# Altium schematic sheet ST-LinkV2.SchDoc
size B; SheetNumber: 5; SheetTotal: 6
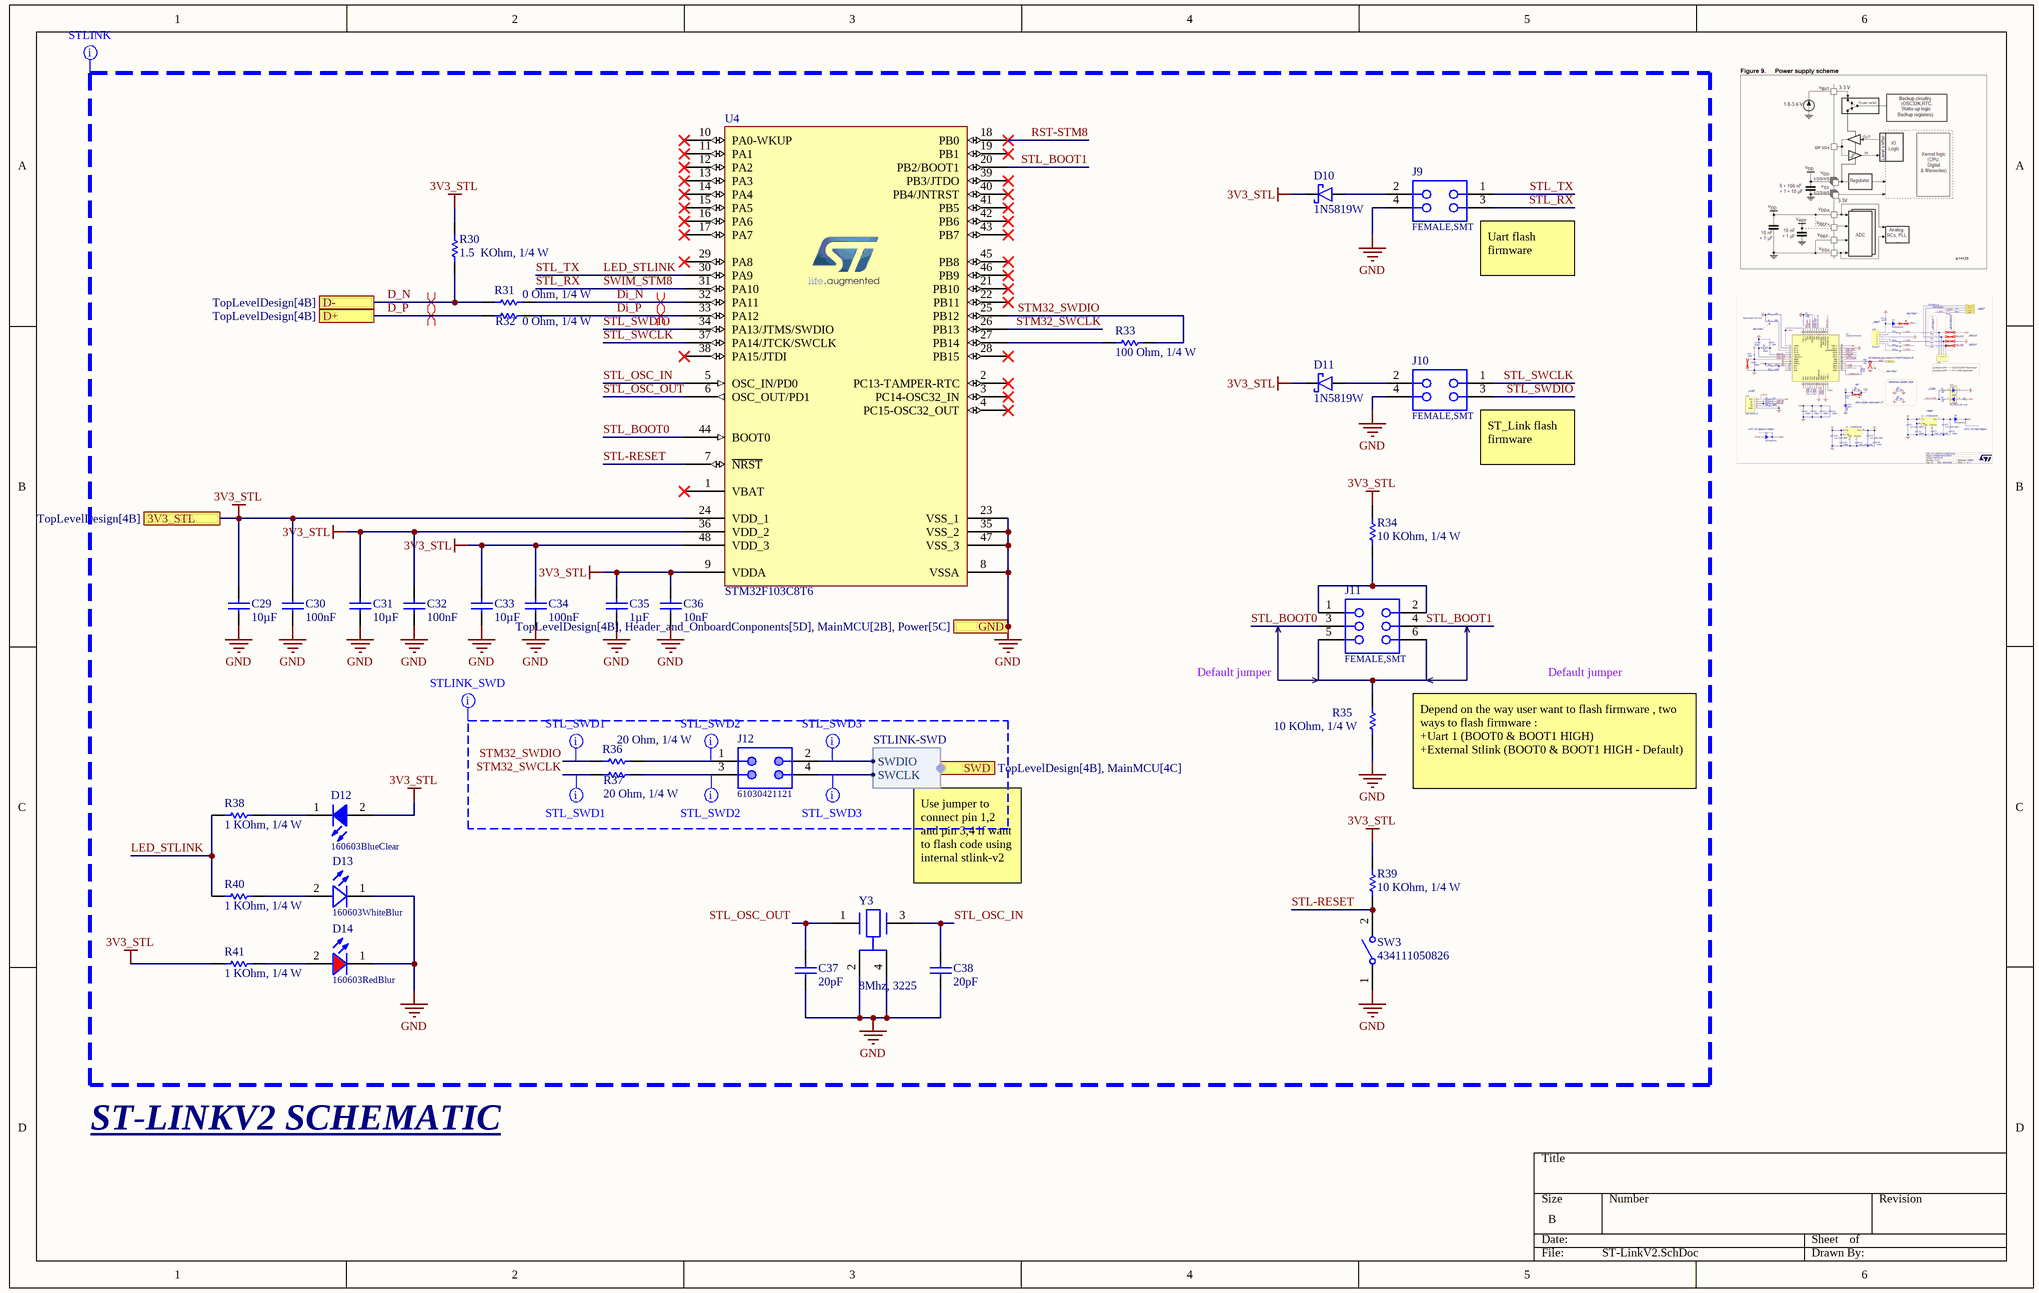
[diagram p0: ST-LinkV2.SchDoc]

## Parts
C29  value 10µF  [CAP_0603]  (hidden comment: 0106031061010)
C30  value 100nF  [CAP_0603]  (hidden comment: 0106031041050)
C31  value 10µF  [CAP_0603]  (hidden comment: 0106031061010)
C32  value 100nF  [CAP_0603]  (hidden comment: 0106031041050)
C33  value 10µF  [CAP_0603]  (hidden comment: 0106031061010)
C34  value 100nF  [CAP_0603]  (hidden comment: 0106031041050)
C35  value 1µF  [CAP_0603]  (hidden comment: 0106031051016)
C36  value 10nF  [CAP_0603]  (hidden comment: 0106031030550)
C37  value 20pF  [CAP_0603]  (hidden comment: 0106031000550)
C38  value 20pF  [CAP_0603]  (hidden comment: 0106031000550)
D10  1N5819W  [1N5819W]
D11  1N5819W  [1N5819W]
D12  160603BlueClear  [WL-SMCW_0603_H=0.7mm]
D13  160603WhiteBlur  [WL-SMCW_0603_H=0.7mm]
D14  160603RedBlur  [WL-SMCW_0603_H=0.7mm]
J9  FEMALE,SMT  [61000421821]
J10  FEMALE,SMT  [61000421821]
J11  FEMALE,SMT  [61030621821]
J12  61030421121  [61030421121]
R30  value 1.5  KOhm, 1/4 W  [resistor_0603]  (hidden comment: 0006031521)
R31  value 0 Ohm, 1/4 W  [resistor_0603]  (hidden comment: 0006030001)
R32  value 0 Ohm, 1/4 W  [resistor_0603]  (hidden comment: 0006030001)
R33  value 100 Ohm, 1/4 W  [resistor_0603]  (hidden comment: 0006031011)
R34  value 10 KOhm, 1/4 W  [resistor_0603]  (hidden comment: 0006031031)
R35  value 10 KOhm, 1/4 W  [resistor_0603]  (hidden comment: 0006031031)
R36  value 20 Ohm, 1/4 W  [resistor_0603]  (hidden comment: 0006032001)
R37  value 20 Ohm, 1/4 W  [resistor_0603]  (hidden comment: 0006032001)
R38  value 1 KOhm, 1/4 W  [resistor_0603]  (hidden comment: 0006031021)
R39  value 10 KOhm, 1/4 W  [resistor_0603]  (hidden comment: 0006031031)
R40  value 1 KOhm, 1/4 W  [resistor_0603]  (hidden comment: 0006031021)
R41  value 1 KOhm, 1/4 W  [resistor_0603]  (hidden comment: 0006031021)
SW3  434111050826  [WS-TASV_L6W3.5H5_4341x10508x6]
U4  STM32F103C8T6  [STM32F103C8T6]
Y3  8Mhz, 3225  [FP-NX3225SA-MFG]

## Ports
3V3_STL (see TopLevelDesign[4B]), D+ (see TopLevelDesign[4B]), D- (see TopLevelDesign[4B]), GND (see TopLevelDesign[4B], Header_and_OnboardConponents[5D], MainMCU[2B], Power[5C]), SWD (harness STLINK-SWD, see TopLevelDesign[4B], MainMCU[4C])

## Harnesses
STLINK-SWD: SWDIO, SWCLK

## Nets
3V3_STL: C29.2 C30.2 C31.2 C32.2 C33.2 C34.2 C35.2 C36.2 D10.K D11.K D12.2(A) R30.2 R34.2 R39.2 R41.1 U4.9(VDDA) U4.24(VDD_1) U4.36(VDD_2) U4.48(VDD_3) ; port 3V3_STL
GND: C29.1 C30.1 C31.1 C32.1 C33.1 C34.1 C35.1 C36.1 C37.1 C38.1 D13.1(K) D14.1(K) J9.4 J10.4 R35.1 SW3.1 U4.8(VSSA) U4.23(VSS_1) U4.35(VSS_2) U4.47(VSS_3) Y3.2(GND) Y3.4(GND) ; port GND
D_N: R30.1 R31.1 ; port D-
D_P: R32.1 ; port D+
Di_N: R31.2 U4.32(PA11)
Di_P: R32.2 U4.33(PA12)
LED_STLINK: J9.1 R38.1 R40.1 U4.30(PA9)  [also labelled STL_TX]
RST-STM8: U4.18(PB0)
STL-RESET: R39.1 SW3.2 U4.7(~{NRST})
STL_BOOT0: J11.3 U4.44(BOOT0)
STL_BOOT1: J11.4 U4.20(PB2/BOOT1)
STL_OSC_IN: C38.2 U4.5(OSC_IN/PD0) Y3.3
STL_OSC_OUT: C37.2 U4.6(OSC_OUT/PD1) Y3.1
STL_RX: J9.3 U4.31(PA10)  [also labelled SWIM_STM8]
STL_SWCLK: J10.1 U4.37(PA14/JTCK/SWCLK)
STL_SWDIO: J10.3 U4.34(PA13/JTMS/SWDIO)
STM32_SWCLK: R37.1 U4.26(PB13)
STM32_SWDIO: R33.1 R36.1 U4.25(PB12)
NetD10_A: D10.A J9.2
NetD11_A: D11.A J10.2
NetD12_1: D12.1(K) R38.2
NetD13_2: D13.2(A) R40.2
NetD14_2: D14.2(A) R41.2
NetJ11_1: J11.1 J11.2 R34.1
NetJ11_5: J11.5 J11.6 R35.2
NetJ12_1: J12.1 R36.2
NetJ12_2: J12.2 ; port SWD.SWDIO
NetJ12_3: J12.3 R37.2
NetJ12_4: J12.4 ; port SWD.SWCLK
NetR33_2: R33.2 U4.27(PB14)

Not connected (* = marked no-connect by the designer): U4 1(VBAT)* 2(PC13-TAMPER-RTC)* 3(PC14-OSC32_IN)* 4(PC15-OSC32_OUT)* 10(PA0-WKUP)* 11(PA1)* 12(PA2)* 13(PA3)* 14(PA4)* 15(PA5)* 16(PA6)* 17(PA7)* 19(PB1)* 21(PB10)* 22(PB11)* 28(PB15)* 29(PA8)* 38(PA15/JTDI)* 39(PB3/JTDO)* 40(PB4/JNTRST)* 41(PB5)* 42(PB6)* 43(PB7)* 45(PB8)* 46(PB9)*

## Layout directives
differential pair: D_N, D_P, Di_N, Di_P
net class STLINK_SWD; rule Matched Net Lengths [Delay Tolerance = 70ps]: STM32_SWCLK, STM32_SWDIO
net class STLINK; rule Differential Pairs Routing [Pref Gap = 10mil    Min Gap  = 10mil    Max Gap  = 10milPref Width = 7mil    Min Width  = 7mil    Max Width  = 10mil]: 3V3_STL, D_N, D_P, Di_N, Di_P, GND, LED_STLINK, RST-STM8, STL-RESET, STL_BOOT0, STL_BOOT1, STL_OSC_IN, STL_OSC_OUT, STL_RX, STL_SWCLK, STL_SWDIO, STL_TX, STM32_SWCLK, STM32_SWDIO, SWIM_STM8
rule Matched Net Lengths [Delay Tolerance = 50ps]; net class STL_SWD1: STM32_SWCLK, STM32_SWDIO
rule Matched Net Lengths [Delay Tolerance = 50ps]; net class STL_SWD2: NetJ12_1, NetJ12_3
rule Matched Net Lengths [Delay Tolerance = 50ps]; net class STL_SWD3: NetJ12_2, NetJ12_4

## Notes on the sheet
- (near J9) Uart flash firmware
- (near J10) ST_Link flash firmware
- Default jumper
- Depend on the way user want to flash firmware , two ways to flash firmware :
  +Uart 1 (BOOT0 & BOOT1 HIGH)
  +External Stlink (BOOT0 & BOOT1 HIGH - Default)
- (near Y3) Use jumper to connect pin 1,2 and pin 3,4 if want to flash code using internal stlink-v2
- ST-LINKV2 SCHEMATIC

## Library data of the parts
C29 C31 C33 = CMP-001-00219-1: CAP, size 0603, 10 uF, 10 VDC; Manufacture Name: Samsung Electro-Mechanics; Manufacture SN: CL10A106KP8NNWC; Voltage Rating DC: 10 VDC; Tolerance: 10%; Supplier 3 Name: thegioiic; Supplier 2 Name: Digi-Key; Design Item ID: 0106031061010; Size: 0603; Packaging: Tape and Reel; Supplier 1 URL: https://www.mouser.vn/ProductDetail/Samsung-Electro-Mechanics/CL10A106KP8NNWC?qs=xZ%2FP%252Ba9zWqZx8LSX23YqWA%3D%3D&utm_source=mouser-refine-download&utm_medium=file&utm_campaign=CL10A106KP8NNWC&utm_content=Samsung-Electro-Mechanics; Supplier 3 SN: N/A; Component Type: Standard; Supplier 2 SN: 1276-CL10A106KP8NNWCTR-ND; Supplier 1 Name: Mouser; Supplier 2 URL: https://www.digikey.com/en/products/detail/samsung-electro-mechanics/cl10a106kp8nnwc/16572907; Source: Capacitor_0603_10_percent.SchLib; Supplier 3 URL: https://www.thegioiic.com/tu-gom-0603-10uf-25v; Pins: 2; Supplier 1 SN: 187-CL10A106KP8NNWC; Operating Temperature: -55 to +125degC; Mounting Technology: SMT
C30 C32 C34 = CMP-001-00214-1: CAP, size 0603, 100 nF, 50 VDC; Manufacture SN: CGA3E3X8R1H104K080AE; Manufacture Name: TDK; Tolerance: 10%; Voltage Rating DC: 50 VDC; Supplier 2 Name: Digi-Key; Pins: 2; Supplier 3 Name: thegioiic; Design Item ID: 0106031041050; Supplier 1 Name: Mouser; Supplier 1 URL: https://www.mouser.com/ProductDetail/TDK/CGA3E3X8R1H104K080AE?qs=nQSIdc08i%252Bd8g3IRRgU2bw%3D%3D&utm_source=mouser-refine-download&utm_medium=file&utm_campaign=CGA3E3X8R1H104K080AE&utm_content=TDK; Size: 0603; Supplier 2 URL: https://www.digikey.com/en/products/detail/tdk-corporation/cga3e3x8r1h104k080ae/5809262; Operating Temperature: -55 to +125degC; Packaging: Tape and Reel; Source: Capacitor_0603_10_percent.SchLib; Supplier 1 SN: 810-CGA3E3X8R1H104KA; Supplier 3 SN: N/A; Supplier 2 SN: 445-173697-2-ND; Mounting Technology: SMT; Supplier 3 URL: N/A; Component Type: Standard
C35 = CMP-001-00215-1: CAP, size 0603, 1 uF, 16 VDC; Manufacture Name: Samsung Electro-Mechanics; Manufacture SN: CL10B105KO8NNWC; Voltage Rating DC: 16 VDC; Tolerance: 10%; Supplier 3 Name: thegioiic; Operating Temperature: -55 to +125degC; Supplier 2 URL: https://www.digikey.com/en/products/detail/samsung-electro-mechanics/cl10b105ko8nnwc/16572783; Supplier 1 Name: Mouser; Supplier 2 Name: Digi-Key; Component Type: Standard; Source: Capacitor_0603_10_percent.SchLib; Packaging: Tape and Reel; Mounting Technology: SMT; Supplier 2 SN: 1276-CL10B105KO8NNWCTR-ND; Size: 0603; Pins: 2; Supplier 1 URL: https://www.mouser.vn/ProductDetail/Samsung-Electro-Mechanics/CL10B105KO8NNWC?qs=81r%252BiQLm7BT%252BXtc72qn1ug%3D%3D&utm_source=mouser-refine-download&utm_medium=file&utm_campaign=CL10B105KO8NNWC&utm_content=Samsung-Electro-Mechanics; Supplier 3 SN: N/A; Supplier 1 SN: 187-CL10B105KO8NNWC; Design Item ID: 0106031051016; Supplier 3 URL: https://www.thegioiic.com/tu-gom-0603-1uf-16v
C36 = CMP-001-00212-1: CAP, size 0603, 10 nF, 50 VDC; Manufacture SN: CGA3E2C0G1H103J080AE; Manufacture Name: TDK; Tolerance: 5%; Voltage Rating DC: 50 VDC; Design Item ID: 0106031030550; Pins: 2; Operating Temperature: -55 to +125degC; Packaging: Tape and Reel; Supplier 1 SN: 810-CGA3E2C0G1H103J8; Source: Capacitor_0603_5_percent.SchLib; Supplier 3 URL: N/A; Component Type: Standard; Supplier 3 SN: N/A; Supplier 2 Name: Digi-Key; Mounting Technology: SMT; Supplier 3 Name: thegioiic; Supplier 1 URL: https://www.mouser.com/ProductDetail/TDK/CGA3E2C0G1H103J080AE?qs=P1JMDcb91o6ZkMITrWTUZQ%3D%3D&utm_source=mouser-refine-download&utm_medium=file&utm_campaign=CGA3E2C0G1H103J080AE&utm_content=TDK; Supplier 2 URL: https://www.digikey.com/en/products/detail/tdk-corporation/cga3e2c0g1h103j080ae/11697946; Supplier 2 SN: 445-CGA3E2C0G1H103J080AETR-ND; Supplier 1 Name: Mouser; Size: 0603
C37 C38 = CMP-001-00208-1: CAP, size 0603, 20 pF, 50 VDC; Manufacture SN: CGA3E2NP01H100D080AA; Manufacture Name: TDK; Tolerance: 5%; Voltage Rating DC: 50 VDC; Component Type: Standard; Size: 0603; Source: Capacitor_0603_5_percent.SchLib; Supplier 3 SN: N/A; Supplier 2 URL: https://www.digikey.com/en/products/detail/tdk-corporation/cga3e2np01h100d080aa/3949623; Supplier 1 Name: Mouser; Pins: 2; Supplier 1 SN: 810-CGA3E2NP01H100DA; Packaging: Tape and Reel; Supplier 2 Name: Digi-Key; Supplier 3 Name: thegioiic; Supplier 2 SN: 445-12387-2-ND; Operating Temperature: -55 to +125degC; Supplier 1 URL: https://www.mouser.com/ProductDetail/TDK/CGA3E2NP01H100D080AA?qs=xLDY6iXSiQYSDBjUp7bVxg%3D%3D&utm_source=mouser-refine-download&utm_medium=file&utm_campaign=CGA3E2NP01H100D080AA&utm_content=TDK; Design Item ID: 0106031000550; Supplier 3 URL: N/A; Mounting Technology: SMT
D10 D11 = CMP-004-00113-1: Source: 1N5819W.SchLib; Design Item ID: 1N5819W; Pins: 2; Component Type: Standard
D12 = CMP-004-00088-1: WL-SMCW SMT Mono-color Chip LED Waterclear, size 0603, Blue, 3.2V, 140deg; Type: Clear; Supplier 2 SN: 160-1647-2-ND; Pins: 2; Supplier 1 SN: 710-150060GS75000; ComponentLink3URL: https://www.digikey.com/en/products/detail/liteon/LTST-C191TBKT/388530; Color: Blue; Supplier 3 Name: ICDayRoi; Supplier 2 Name: Digi-Key; ComponentLink1URL: N/A; Source: WL-SMCW_0603.SchLib; ComponentLink4URL: https://www.thegioiic.com/led-xanh-duong-0603-dan-smd-trong-suot; Supplier 1 Name: Mouser; ComponentLink3Description: Supplier 2 URL; Component Type: Standard; ComponentLink1Description: Datasheet link; Value: Blue, 3.2V; ComponentLink2URL: https://www.mouser.vn/ProductDetail/Wurth-Elektronik/150060BS75003?qs=Li%252BoUPsLEnu8LvIbM48DKA%3D%3D; Size: 0603; Design Item ID: 160603BlueClear; Supplier 2 URL: https://www.digikey.com/en/products/detail/liteon/LTST-C191TBKT/388530; ComponentLink4Description: Supplier 3 URL; Supplier 3 URL: https://www.thegioiic.com/led-xanh-duong-0603-dan-smd-trong-suot; Supplier 3 SN: N/A; ComponentLink2Description: Supplier 1 URL; Supplier 1 URL: https://www.mouser.vn/ProductDetail/Wurth-Elektronik/150060BS75003?qs=Li%252BoUPsLEnu8LvIbM48DKA%3D%3D
D13 = CMP-004-00095-1: WL-SMCW SMT Mono-color Chip LED Blur, size 0603, White; ComponentLink3Description: Supplier 2 URL; Design Item ID: 160603WhiteBlur; Component Type: Standard; Size: 0603; Supplier 1 SN: 755-SMLEN3WBC8W1; Color: White; Supplier 3 Name: ICDayRoi; Supplier 3 URL: N/A; Pins: 2; Supplier 2 URL: https://www.digikey.com/en/products/detail/qt-brightek-qtb/QBLP601-IW/4814655; ComponentLink1URL: N/A; ComponentLink3URL: https://www.digikey.com/en/products/detail/qt-brightek-qtb/QBLP601-IW/4814655; Supplier 1 URL: https://www.mouser.vn/ProductDetail/ROHM-Semiconductor/SMLEN3WBC8W1?qs=W0yvOO0ixfGun78rr9Unsw%3D%3D; ComponentLink2URL: https://www.mouser.vn/ProductDetail/ROHM-Semiconductor/SMLEN3WBC8W1?qs=W0yvOO0ixfGun78rr9Unsw%3D%3D; ComponentLink4Description: Supplier 3 URL; Supplier 1 Name: Mouser; Supplier 3 SN: N/A; ComponentLink4URL: N/A; Source: WL-SMCW_0603.SchLib; Supplier 2 SN: 1516-1057-2-ND; Value: White; Supplier 2 Name: Digi-Key; ComponentLink2Description: Supplier 1 URL; ComponentLink1Description: Datasheet link; Type: Blur
D14 = CMP-004-00093-1: WL-SMCW SMT Mono-color Chip LED Blur, size 0603, Red, 2V, 140deg; Value: Red, 2V; ComponentLink2URL: https://www.mouser.vn/ProductDetail/ROHM-Semiconductor/CSL1901VW1?qs=vvQtp7zwQdNmrXZcE27xEA%3D%3D; Supplier 2 URL: https://www.digikey.com/en/products/detail/rohm-semiconductor/SML-D12U8WT86/1641799; Pins: 2; Supplier 2 Name: Digi-Key; ComponentLink1Description: Datasheet link; ComponentLink3URL: https://www.digikey.com/en/products/detail/rohm-semiconductor/SML-D12U8WT86/1641799; Supplier 1 Name: Mouser; Supplier 1 SN: 755-CSL1901VW1; Size: 0603; ComponentLink1URL: N/A; Source: WL-SMCW_0603.SchLib; ComponentLink3Description: Supplier 2 URL; Type: Blur; Design Item ID: 160603RedBlur; Component Type: Standard; ComponentLink4URL: N/A; Supplier 3 Name: ICDayRoi; Supplier 3 SN: N/A; Color: Red; Supplier 1 URL: https://www.mouser.vn/ProductDetail/ROHM-Semiconductor/CSL1901VW1?qs=vvQtp7zwQdNmrXZcE27xEA%3D%3D; Supplier 2 SN: 511-1580-2-ND; ComponentLink2Description: Supplier 1 URL; Supplier 3 URL: N/A; ComponentLink4Description: Supplier 3 URL
J9 J10 = CMP-002-00342-1: WR-PHD Socket Header, SMT, pitch 2.54mm, Dual Row, Vertical, 4p; Manufacturer: Wurth Elektronik; Withstanding Voltage: 600VAC; Rated Current: 3A; Contact Resistance: 20mOhm; Working Voltage: 250VAC; Pin Number: 4; Design Item ID: 61000421821; ComponentLink3Description: Global Supply; Supplier 1 URL: https://www.mouser.vn/ProductDetail/Wurth-Elektronik/61000421821?qs=ulEaXIWI0c%2F%252BuIEt%2FF6jcQ%3D%3D; ComponentLink2URL: https://www.we-online.com/catalog/datasheet/61000421821.pdf; Gender: Socket Header; Supplier 2 URL: N/A; Supplier 2 SN: N/A; ComponentLink2Description: Datasheet; Supplier 1 SN: 710-61000421821; Component Type: Standard; ComponentLink1URL: http://www.we-online.de; Mounting Technology: SMT; Pins: 4; Published Date: May 2020; Pitch: 2.54mm; Supplier 2 Name: Digi-Key; Orientation: Vertical; Source: WR-PHD_Socket Header_2.54mm.SchLib; Supplier 1 Name: Mouser; Operating Temperature: -40 to +105degC; Row Number: Dual; ComponentLink3URL: https://www.we-online.com/en/components/products/PHD_2_54_SMT_DUAL_SOCKET_HEADER_6100XX21821?sq=61000421821#61000421821; Manufacturer Part Number: 61000421821; ComponentLink1Description: Manufacturer; Supplier 3 URL: https://www.thegioiic.com/hang-rao-cai-doi-2-54mm-4-chan-2-hang-smd; Packaging: Tube; ComponentLink4URL: https://www.mouser.vn/ProductDetail/Wurth-Elektronik/61000421821?qs=ulEaXIWI0c%2F%252BuIEt%2FF6jcQ%3D%3D; ComponentLink5Description: Local Supply; Supplier 3 SN: N/A; Supplier 3 Name: thegioiic; ComponentLink4Description: Global Supply; ComponentLink5URL: https://www.thegioiic.com/hang-rao-cai-doi-2-54mm-4-chan-2-hang-smd
J11 = CMP-002-00440-1: WR-PHD Socket Header, SMT, pitch 2.54mm, Dual Row, Vertical, 6p; Manufacturer: Wurth Elektronik; Rated Current: 3A; Contact Resistance: 20mOhm; Pin Number: 6; Withstanding Voltage: 600VAC; Working Voltage: 250VAC; ComponentLink2URL: https://www.we-online.com/catalog/datasheet/61030621821.pdf; Design Item ID: 61030621821; Supplier 1 SN: 710-61030621821; Row Number: Dual; Orientation: Vertical; Packaging: Tape and Reel; Supplier 2 SN: N/A; ComponentLink2Description: Datasheet; Supplier 1 Name: Mouser; Component Type: Standard; Published Date: May 2020; Pins: 6; ComponentLink3Description: Global Supply; Operating Temperature: -40 to +105degC; Supplier 1 URL: https://www.mouser.vn/ProductDetail/Wurth-Elektronik/61030621821?qs=Cb2nCFKsA8prWiqa1E1TsA%3D%3D; Supplier 2 Name: Digi-Key; Supplier 2 URL: N/A; Manufacturer Part Number: 61030621821; Pitch: 2.54mm; ComponentLink1URL: http://www.we-online.de; ComponentLink4URL: https://www.mouser.vn/ProductDetail/Wurth-Elektronik/61030621821?qs=Cb2nCFKsA8prWiqa1E1TsA%3D%3D; Mounting Technology: SMT; ComponentLink1Description: Manufacturer; Supplier 3 Name: thegioiic; ComponentLink3URL: https://www.we-online.com/en/components/products/PHD_2_54_SMT_DUAL_SOCKET_HEADER_6100XX21821?sq=61030621821#61030621821; ComponentLink4Description: Global Supply; Supplier 3 URL: N/A; Gender: Socket Header; Supplier 3 SN: N/A; Source: WR-PHD_Socket Header_2.54mm.SchLib
J12 = CMP-002-00436-1: WR-PHD Pin Header, SMT, pitch 2.54mm, Dual Row, Vertical, 4p; Manufacturer: Wurth Elektronik; Rated Current: 3A; Supply name 1: Mouser; Working Voltage: 250VAC; Withstanding Voltage: 500VAC; Contact Resistance: 20mOhm; Pin Number: 4; ComponentLink1URL: http://www.we-online.de; Supplier 2 SN: N/A; Supplier 1 URL: https://www.mouser.vn/ProductDetail/Wurth-Elektronik/61030421121?qs=PhR8RmCirEbubONBDfvqcw%3D%3D; ComponentLink4URL: https://www.mouser.vn/ProductDetail/Wurth-Elektronik/61030421121?qs=PhR8RmCirEbubONBDfvqcw%3D%3D; Supplier 1 Name: Mouser; Pitch: 2.54mm; ComponentLink1Description: Manufacturer; Row Number: Dual; Manufacturer Part Number: 61030421121; Packaging: Tape and Reel; ComponentLink3Description: Global Supply; Supplier 3 URL: N/A; ComponentLink4Description: Global Supply; Supplier 1 SN: 710-61030421121; Component Type: Standard; Source: WR-PHD_Pin Header_2.54mm.SchLib; Mounting Technology: SMT; ComponentLink2Description: Datasheet; Supplier 2 Name: Digi-Key; Operating Temperature: -40 to +125degC; Published Date: May 2020; Design Item ID: 61030421121; ComponentLink2URL: https://www.we-online.com/catalog/datasheet/61030421121.pdf; Orientation: Vertical; Supplier 2 URL: N/A; ComponentLink3URL: https://www.we-online.com/en/components/products/PHD_2_54_SMT_DUAL_PIN_HEADER_6100XX21121?sq=61030421121#61030421121; Gender: Pin Header; Pins: 4; Supplier 3 Name: thegioiic; Supplier 3 SN: N/A
R30 = CMP-009-00235-1: RES, size 0603, 1.5  KOhm, 1/4 W; Manufacture  Name: OEM; Rated Power: 1/4 W; Resistance Tolerance: +/-1%; ComponentLink4Description: Supplier 3 URL; ComponentLink3Description: Supplier 2 URL; Design Item ID: 0006031521; Pins: 2; ComponentLink4URL: N/A; ComponentLink1Description: Datasheet link; Supplier 2 Name: Digi-Key; Supplier 3 URL: N/A; Size: 0603; Supplier 2 SN: 13-RC0603FR-071R5LTR-ND; Supplier 1 URL: https://www.mouser.vn/ProductDetail/ROHM-Semiconductor/SFR03EZPF1501?qs=byeeYqUIh0NryWvnzlukLQ%3D%3D; Manufacture  SN: OEM; ComponentLink1URL: N/A; Supplier 1 Name: Mouser; Supplier 3 Name: thegioiic; Supplier 2 URL: https://www.digikey.com/en/products/detail/yageo/RC0603FR-071R5L/5918292; Supplier 3 SN: N/A; Supplier 1 SN: 755-SFR03EZPF1501; Source: Resistor_0603.SchLib; ComponentLink2URL: N/A; ComponentLink2Description: Supplier 1 URL; Mounting Technology: SMT; Component Type: Standard; ComponentLink3URL: https://www.digikey.com/en/products/detail/yageo/RC0603FR-071R5L/5918292
R31 R32 = CMP-009-00180-1: RES, size 0603, 0 Ohm, 1/4 W; Manufacture  Name: YAGEO; Manufacture  SN: AC0603FR-070RL; Resistance Tolerance: +/-1%; Rated Power: 1/4 W; Pins: 2; ComponentLink1Description: Datasheet link; ComponentLink4URL: N/A; Component Type: Standard; ComponentLink2URL: N/A; Supplier 2 URL: https://www.digikey.com/en/products/detail/yageo/ac0603fr-070rl/2827812; Supplier 1 Name: Mouser; Supplier 1 SN: 603-AC0603FR-070RL; ComponentLink1URL: https://www.mouser.com/datasheet/2/447/Yageo_06282023_ACseries-3224032.pdf; Mounting Technology: SMT; ComponentLink2Description: Supplier 1 URL; Size: 0603; Supplier 2 SN: 311-0.0LDTR-ND; ComponentLink4Description: Supplier 3 URL; ComponentLink3URL: https://www.digikey.com/en/products/detail/yageo/ac0603fr-070rl/2827812; ComponentLink3Description: Supplier 2 URL; Supplier 3 Name: thegioiic; Supplier 3 SN: N/A; Supplier 2 Name: Digi-Key; Source: Resistor_0603.SchLib; Design Item ID: 0006030001; Supplier 3 URL: https://www.thegioiic.com/dien-tro-0-ohm-0603-1-; Supplier 1 URL: https://www.mouser.com/ProductDetail/YAGEO/AC0603FR-070RL?qs=sGAEpiMZZMtlubZbdhIBIOG3KwTtqrl%2FD2D%252BGuMCfoY%3D
R33 = CMP-009-00184-1: RES, size 0603, 100 Ohm, 1/4 W; Manufacture  SN: OEM; Resistance Tolerance: +/-1%; Rated Power: 1/4 W; Supplier 2 URL: https://www.digikey.com/en/products/detail/yageo/SR0603FR-7T100RL/9373096https://www.digikey.com/en/products/detail/yageo/SR0603FR-7T100RL/9373096; Pins: 2; Supplier 1 Name: Mouser; Manufacture  Name: OEM; Design Item ID: 0006031011; Supplier 2 Name: Digi-Key; Supplier 2 SN: YAG5822TR-ND YAG5822CT-ND YAG5822DKR-ND; ComponentLink1URL: https://www.yageo.com/upload/media/product/productsearch/datasheet/rchip/PYu-SR_20105_RoHS_L_10.pdf; ComponentLink1Description: Datasheet link; ComponentLink4Description: Supplier 3 URL; Source: Resistor_0603.SchLib; Supplier 1 URL: https://www.mouser.vn/ProductDetail/YAGEO/SR0603FR-7T100RL?qs=sGAEpiMZZMvdGkrng054tz1y1XEHv7sNOEBvi%2FAEoxbcgRjDGFawVw%3D%3D; ComponentLink2Description: Supplier 1 URL; ComponentLink3Description: Supplier 2 URL; ComponentLink2URL: N/A; Supplier 3 URL: N/A; Size: 0603; ComponentLink3URL: https://www.digikey.com/en/products/detail/yageo/SR0603FR-7T100RL/9373096https://www.digikey.com/en/products/detail/yageo/SR0603FR-7T100RL/9373096; Supplier 3 Name: thegioiic; Supplier 1 SN: 603-SR0603FR-7T100RL; Supplier 3 SN: N/A; ComponentLink4URL: N/A; Mounting Technology: SMT; Component Type: Standard
R34 R35 R39 = CMP-009-00188-1: RES, size 0603, 10 KOhm, 1/4 W; Manufacture  Name: OEM; Rated Power: 1/4 W; Resistance Tolerance: +/-1%; ComponentLink1Description: Datasheet link; Size: 0603; Supplier 2 SN: RHM10KADTR-ND RHM10KADCT-ND RHM10KADDKR-ND; Mounting Technology: SMT; ComponentLink2URL: N/A; Design Item ID: 0006031031; Supplier 1 Name: Mouser; Component Type: Standard; Supplier 2 URL: https://www.digikey.com/en/products/detail/rohm-semiconductor/ESR03EZPF1002/1983429; Manufacture  SN: OEM; Supplier 2 Name: Digi-Key; Supplier 3 URL: N/A; Source: Resistor_0603.SchLib; ComponentLink1URL: https://fscdn.rohm.com/en/products/databook/datasheet/passive/resistor/chip_resistor/esr-e.pdf; Pins: 2; ComponentLink3Description: Supplier 2 URL; Supplier 1 URL: https://www.mouser.vn/ProductDetail/ROHM-Semiconductor/ESR03EZPF1002?qs=sGAEpiMZZMvdGkrng054t67Efho1F8r6CDeAsqwFse8%3D; Supplier 1 SN: 755-ESR03EZPF1002; Supplier 3 SN: N/A; ComponentLink3URL: https://www.digikey.com/en/products/detail/rohm-semiconductor/ESR03EZPF1002/1983429; ComponentLink4Description: Supplier 3 URL; Supplier 3 Name: thegioiic; ComponentLink2Description: Supplier 1 URL; ComponentLink4URL: N/A
R36 R37 = CMP-009-00265-1: RES, size 0603, 20 Ohm, 1/4 W; Manufacture  Name: OEM; Rated Power: 1/4 W; Resistance Tolerance: +/-1%; Size: 0603; ComponentLink2Description: Supplier 1 URL; Mounting Technology: SMT; Supplier 1 URL: https://www.mouser.vn/ProductDetail/Panasonic/ERJ-H3EF20R0V?qs=eP2BKZSCXI5MeliV8G5lXA%3D%3D; ComponentLink3Description: Supplier 2 URL; Design Item ID: 0006032001; ComponentLink4URL: N/A; ComponentLink1URL: N/A; Source: Resistor_0603.SchLib; Supplier 2 URL: https://www.digikey.com/en/products/detail/yageo/RC0603FR-1020RL/14008331; ComponentLink2URL: N/A; ComponentLink4Description: Supplier 3 URL; Supplier 1 Name: Mouser; Supplier 3 SN: N/A; Supplier 2 Name: Digi-Key; Manufacture  SN: OEM; Supplier 2 SN: 13-RC0603FR-1020RLTR-ND; Supplier 3 URL: N/A; Component Type: Standard; Supplier 1 SN: 667-ERJ-H3EF20R0V; Supplier 3 Name: thegioiic; ComponentLink3URL: https://www.digikey.com/en/products/detail/yageo/RC0603FR-1020RL/14008331; Pins: 2; ComponentLink1Description: Datasheet link
R38 R40 R41 = CMP-009-00186-1: RES, size 0603, 1 KOhm, 1/4 W; Manufacture  SN: OEM; Rated Power: 1/4 W; Resistance Tolerance: +/-1%; Supplier 1 SN: 71-RCS06031K00FKEA; ComponentLink4Description: Supplier 3 URL; ComponentLink2Description: Supplier 1 URL; Supplier 3 SN: N/A; Supplier 2 Name: Digi-Key; ComponentLink3Description: Supplier 2 URL; Pins: 2; ComponentLink4URL: N/A; Source: Resistor_0603.SchLib; ComponentLink3URL: https://www.digikey.com/en/products/detail/yageo/SR0603FR-7T1KL/9373103; Supplier 2 SN: YAG5829TR-ND YAG5829CT-ND YAG5829DKR-ND; Supplier 2 URL: https://www.digikey.com/en/products/detail/yageo/SR0603FR-7T1KL/9373103; Supplier 1 Name: Mouser; Component Type: Standard; ComponentLink2URL: N/A; Size: 0603; Supplier 1 URL: https://www.mouser.vn/ProductDetail/Vishay-Dale/RCS06031K00FKEA?qs=sGAEpiMZZMvdGkrng054t9clqp6gtJJdzI9PGMrTQi4RTIuHToNahw%3D%3D; Supplier 3 URL: N/A; Design Item ID: 0006031021; Mounting Technology: SMT; ComponentLink1URL: https://www.yageo.com/upload/media/product/productsearch/datasheet/rchip/PYu-SR_20105_RoHS_L_10.pdf; ComponentLink1Description: Datasheet link; Supplier 3 Name: thegioiic; Manufacture  Name: OEM
SW3 = CMP-011-00108-1: WS-TASV SMT Tact Switch, L6 x W3.5 x H5mm, 260g, SPST-NO, 12V, 50mA; Manufacturer: Wurth Elektronik; Washable: No; Rated Voltage: 12VDC; Supplier 2 Name: Digi-Key; Design Item ID: 434111050826; Height: 5mm; Supplier 1 SN: 710-434111050826; Manufacturer Part Number: 434111050826; Width: 3.5mm; Terminal Material: Copper Alloy; Supplier 1 URL: https://www.mouser.vn/ProductDetail/Wurth-Elektronik/434111050826?qs=wr8lucFkNMW%252BYjUPWhhK5A%3D%3D; Source: Button.SchLib; Contact Material: Stainless Steel; Supplier 3 SN: N/A; Component Type: Standard; Supplier 2 URL: https://www.digikey.com/en/products/detail/w%C3%BCrth-elektronik/434111050826/5209074; Circuit: SPST-NO; Supplier 2 SN: 732-7041-2-ND; Match Code: WS-TASV; Terminal Plating: Silver; Supplier 3 Name: Thegioiic; Pins: 2; Category: Tact Switches; Supplier 3 URL: https://www.thegioiic.com/nut-nhan-3-5x6mm-cao-5mm-2-chan-smd-dau-trang; Packaging: Tape and Reel; Operating Temperature Max: 85°C; Mount: Surface Mount; Rated Current: 50mA; Operation Force: 260g; Operating Temperature Min: -40°C; Length: 6mm; Supplier 1 Name: Mouser
U4 = STM32F103C8T6-000006-1: ARM Microcontrollers - MCU 32BIT Cortex M3 64KB 20KB RAM 2X12 ADC; Manufacture SN: STM32F103C8T6TR; Manufacturer: STM; Pad count: 48; Value: STM32F103C8T6; Pins: 48; ComponentLink1URL: https://www.mouser.com/datasheet/2/389/stm32f103c8-1851025.pdf; Supplier 3 URL: https://www.thegioiic.com/stm32f103c8t6-32-bit-arm-cortex-m3-microcontroller-72mhz-64kb-flash-48-lqfp; Supplier 1 URL: https://www.mouser.com/ProductDetail/STMicroelectronics/STM32F103C8T6?qs=bhCVus9SdFtq6kqxsU5%2FDA%3D%3D; Supplier 1 Name: Mouser; Component Type: Standard; Part Number: STM32F103C8T6; ComponentLink2URL: https://www.mouser.com/ProductDetail/STMicroelectronics/STM32F103C8T6?qs=bhCVus9SdFtq6kqxsU5%2FDA%3D%3D; Source: STM32.SchLib; Supplier 2 URL: https://www.digikey.com/en/products/detail/stmicroelectronics/stm32f103c8t6tr/2122442; Supplier 3 SN: STM32F103C8T6; Supplier 2 SN: 497-17666-2-ND; ComponentLink1Description: Datasheet; Design Item ID: STM32F103C8T6; Supplier 1 SN: 511-STM32F103C8T6; ComponentLink2Description: Supplier 1 URL; Supplier 3 Name: thegioiic; Footprint name: LQFP48; ComponentLink4Description: Supplier 3 URL; ComponentLink3URL: 497-17666-2-ND; ComponentLink3Description: Supplier 2 URL; Supplier 2 Name: Digi-Key; ComponentLink4URL: https://www.thegioiic.com/stm32f103c8t6-32-bit-arm-cortex-m3-microcontroller-72mhz-64kb-flash-48-lqfp
Y3 = CMP-003-00057-1: CRYSTAL 25.0000MHZ 8PF SMD; Manufacturer: NDK; Manufacturer Part Number: NX3225SA-25.000M-STD-CRS-2; Esr: 100; Tolerance: 15ppm; Automotive Grade: Grade 1; Frequency: 25MHz; Load Capacitance: 8pF; Octopart: https://octopart.com/nx3225sa-25.000m-std-crs-2-ndk-51374293; Temperature: -40°C to +125°C; Category: Crys; Source: Components - 28.03.25 - 23.15.SchLib; Component Type: Standard; Lead Free: Yes; Pins: 4; Case/Package: NX3225SA; Temperature Range Low: -40°C; Device Class L3: Crystals; Series: NX3225SA; RoHS: TRUE; Design Item ID: CMP-200220-000002-1; Height: 0.6mm; Automotive: Yes; Device Class L1: Passive Components; Temperature Range High: 125°C; Digikey Description: CRYSTAL 25.0000MHZ 8PF SMD; Device Class L2: Crystals / Oscillators